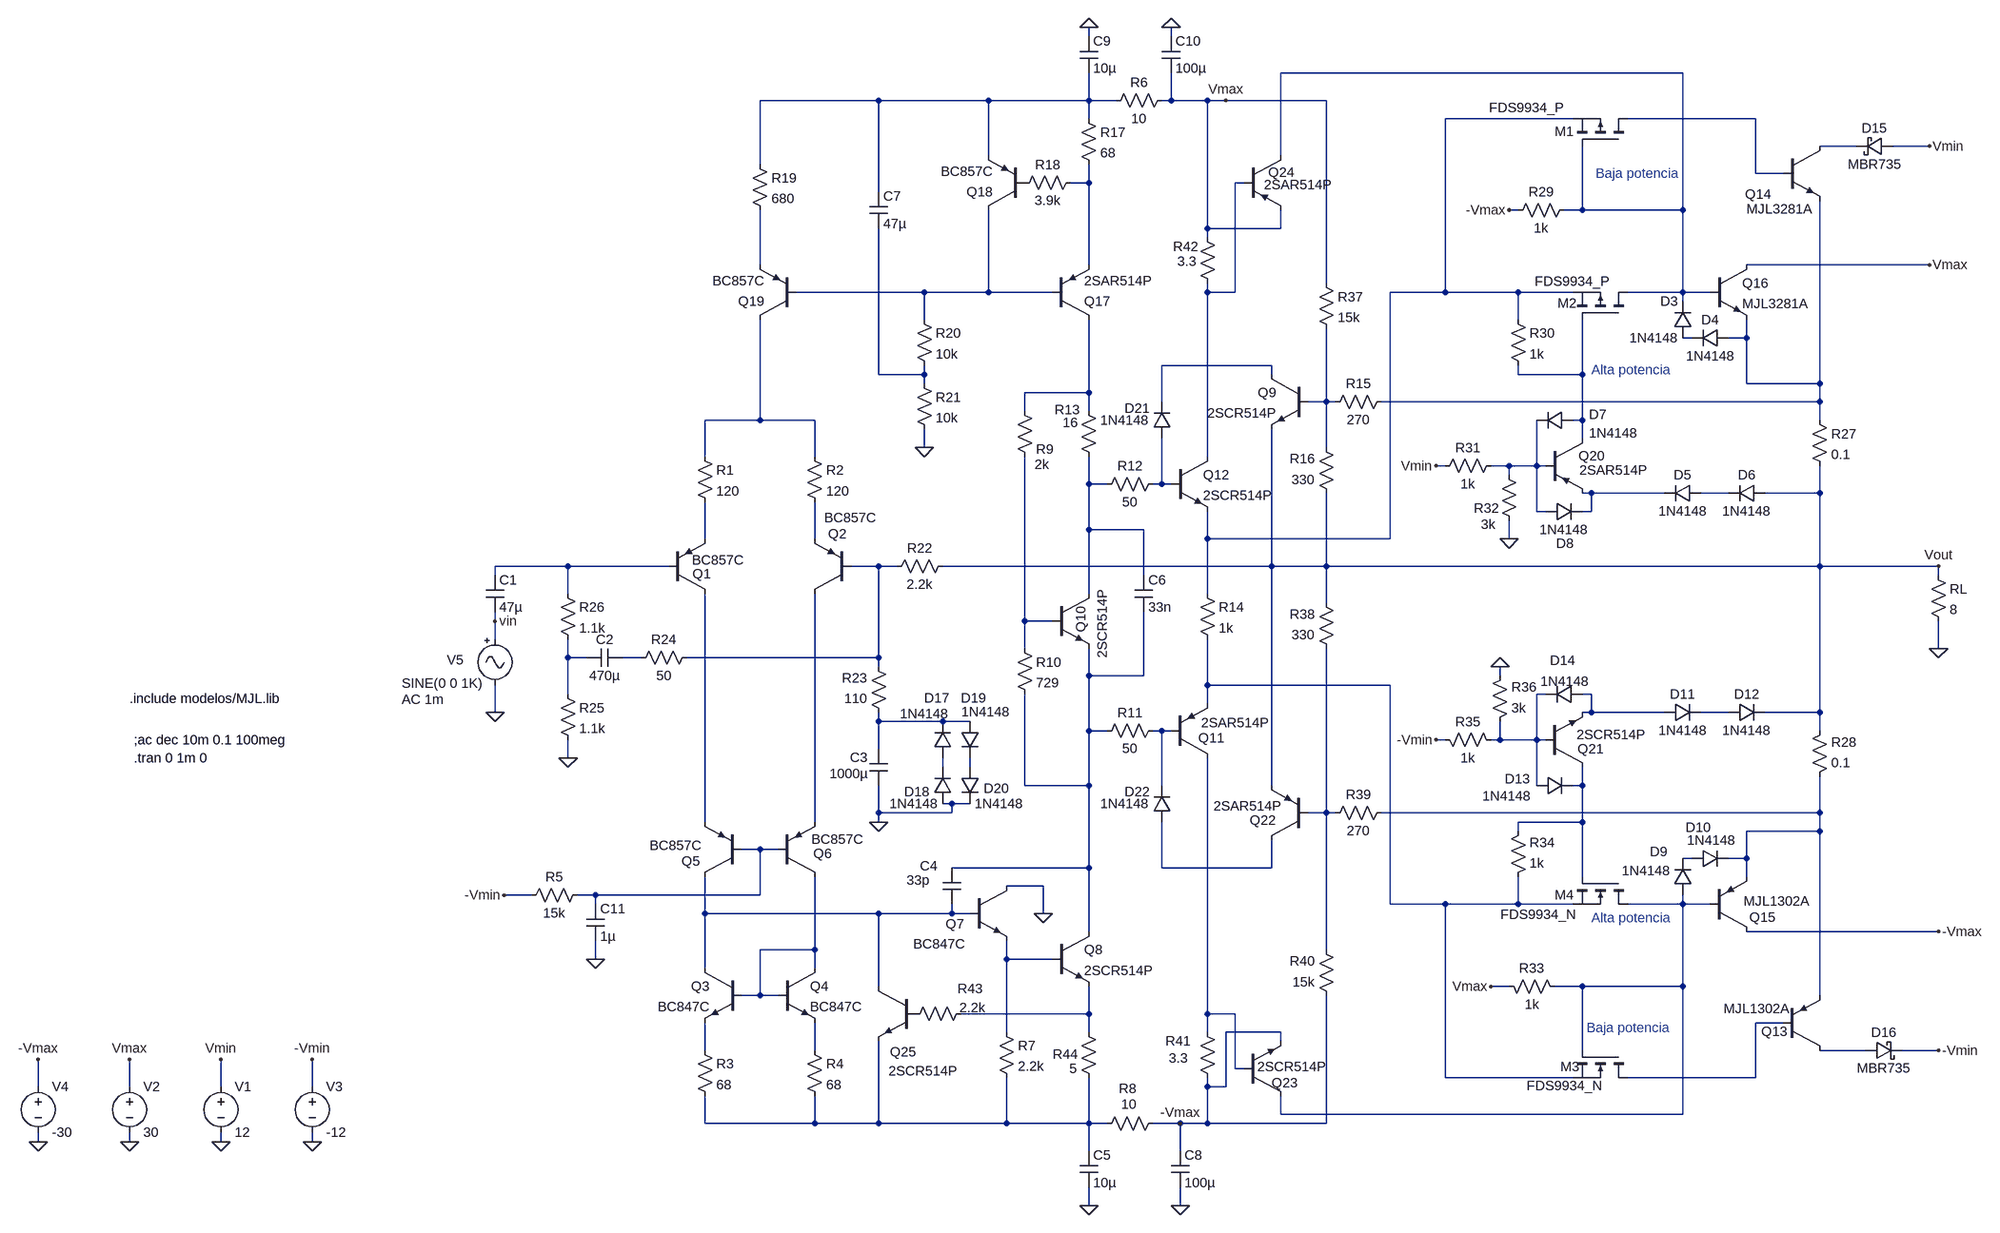
[diagram p0: schematic tp_final_amplificador_completo.asc]
tp_final_amplificador_completo.asc, the LTspice schematic file:
Version 4
SHEET 1 1968 1748
WIRE -512 -320 -512 -336
WIRE -368 -320 -368 -336
WIRE 528 -256 -176 -256
WIRE -880 -208 -1088 -208
WIRE -688 -208 -880 -208
WIRE -512 -208 -512 -256
WIRE -512 -208 -688 -208
WIRE -464 -208 -512 -208
WIRE -368 -208 -368 -256
WIRE -368 -208 -384 -208
WIRE -304 -208 -368 -208
WIRE -272 -208 -304 -208
WIRE -96 -208 -272 -208
WIRE -512 -176 -512 -208
WIRE 336 -176 112 -176
WIRE 656 -176 432 -176
WIRE 832 -128 768 -128
WIRE 960 -128 896 -128
WIRE -688 -112 -688 -208
WIRE -176 -112 -176 -256
WIRE -1088 -96 -1088 -208
WIRE 656 -80 656 -176
WIRE 704 -80 656 -80
WIRE -512 -64 -512 -96
WIRE -512 -64 -544 -64
WIRE -240 -64 -256 -64
WIRE -880 -48 -880 -208
WIRE 240 -16 224 -16
WIRE 352 -16 352 -128
WIRE 352 -16 320 -16
WIRE 528 -16 528 -256
WIRE 528 -16 352 -16
WIRE -304 16 -304 -208
WIRE -176 16 -176 -16
WIRE -176 16 -304 16
WIRE -304 32 -304 16
WIRE -1088 80 -1088 -16
WIRE -512 80 -512 -64
WIRE 960 80 640 80
WIRE -96 112 -96 -208
WIRE -800 128 -1024 128
WIRE -688 128 -688 -16
WIRE -688 128 -800 128
WIRE -576 128 -688 128
WIRE -304 128 -304 112
WIRE -256 128 -256 -64
WIRE -256 128 -304 128
WIRE 112 128 112 -176
WIRE 112 128 16 128
WIRE 240 128 112 128
WIRE 336 128 240 128
WIRE 528 128 528 -16
WIRE 528 128 432 128
WIRE 576 128 528 128
WIRE 528 144 528 128
WIRE -800 176 -800 128
WIRE 240 176 240 128
WIRE 544 208 528 208
WIRE 640 208 640 176
WIRE 640 208 608 208
WIRE -192 256 -384 256
WIRE -880 272 -880 16
WIRE -800 272 -800 256
WIRE -800 272 -880 272
WIRE -192 272 -192 256
WIRE 240 272 240 256
WIRE 352 272 352 176
WIRE 352 272 240 272
WIRE -800 288 -800 272
WIRE 640 288 640 208
WIRE 768 288 768 -32
WIRE 768 288 640 288
WIRE -512 304 -512 176
WIRE -512 304 -624 304
WIRE -384 320 -384 256
WIRE -96 320 -96 192
WIRE -96 320 -128 320
WIRE -80 320 -96 320
WIRE 768 320 768 288
WIRE 768 320 0 320
WIRE -624 336 -624 304
WIRE -512 336 -512 304
WIRE -1088 352 -1088 176
WIRE -1088 352 -1184 352
WIRE -992 352 -1088 352
WIRE 352 352 352 272
WIRE 352 352 336 352
WIRE 768 352 768 320
WIRE 352 384 352 352
WIRE -800 400 -800 368
WIRE -96 400 -96 320
WIRE -1184 416 -1184 352
WIRE -992 416 -992 352
WIRE -304 416 -304 128
WIRE 112 432 96 432
WIRE 224 432 192 432
WIRE 272 432 272 352
WIRE 272 432 224 432
WIRE 288 432 272 432
WIRE 224 448 224 432
WIRE -512 464 -512 416
WIRE -480 464 -512 464
WIRE -384 464 -384 384
WIRE -384 464 -400 464
WIRE -368 464 -384 464
WIRE 368 480 352 480
WIRE 496 480 368 480
WIRE 608 480 560 480
WIRE 768 480 768 432
WIRE 768 480 672 480
WIRE 272 512 272 432
WIRE 288 512 272 512
WIRE 368 512 368 480
WIRE 368 512 352 512
WIRE -512 544 -512 464
WIRE -416 544 -512 544
WIRE -1184 560 -1184 496
WIRE -992 560 -992 496
WIRE -304 560 -304 512
WIRE 16 560 16 128
WIRE 16 560 -304 560
WIRE 224 560 224 528
WIRE -1424 608 -1552 608
WIRE -1248 608 -1424 608
WIRE -880 608 -928 608
WIRE -848 608 -880 608
WIRE -192 608 -192 368
WIRE -192 608 -768 608
WIRE -96 608 -96 480
WIRE -96 608 -192 608
WIRE 768 608 768 480
WIRE 768 608 -96 608
WIRE 976 608 768 608
WIRE -1552 624 -1552 608
WIRE -416 624 -416 544
WIRE 976 624 976 608
WIRE -1424 656 -1424 608
WIRE -512 656 -512 544
WIRE -304 656 -304 560
WIRE -96 672 -96 608
WIRE -1552 704 -1552 688
WIRE -624 704 -624 416
WIRE -576 704 -624 704
WIRE -1552 736 -1552 704
WIRE -624 752 -624 704
WIRE 976 752 976 704
WIRE -1424 768 -1424 736
WIRE -1392 768 -1424 768
WIRE -1296 768 -1328 768
WIRE -880 768 -880 608
WIRE -880 768 -1216 768
WIRE -880 784 -880 768
WIRE -512 800 -512 752
WIRE -416 800 -416 688
WIRE -416 800 -512 800
WIRE 208 800 208 784
WIRE -304 816 -304 736
WIRE 16 816 -304 816
WIRE -1424 832 -1424 768
WIRE 288 832 272 832
WIRE 368 832 352 832
WIRE -304 848 -304 816
WIRE -1552 864 -1552 816
WIRE 368 864 368 832
WIRE 368 864 352 864
WIRE 496 864 368 864
WIRE 608 864 560 864
WIRE 768 864 768 608
WIRE 768 864 672 864
WIRE -880 880 -880 864
WIRE -768 880 -880 880
WIRE -720 880 -768 880
WIRE -512 896 -512 800
WIRE -480 896 -512 896
WIRE -384 896 -400 896
WIRE -368 896 -384 896
WIRE 768 896 768 864
WIRE 112 912 96 912
WIRE 208 912 208 880
WIRE 208 912 192 912
WIRE 272 912 272 832
WIRE 272 912 208 912
WIRE 288 912 272 912
WIRE -880 928 -880 880
WIRE -1424 944 -1424 912
WIRE -768 960 -768 944
WIRE -720 960 -720 944
WIRE -624 992 -624 832
WIRE -512 992 -512 896
WIRE -512 992 -624 992
WIRE -384 992 -384 896
WIRE -192 992 -192 608
WIRE 272 992 272 912
WIRE 352 992 352 960
WIRE 352 992 336 992
WIRE -752 1024 -768 1024
WIRE -720 1024 -752 1024
WIRE -880 1040 -880 992
WIRE -752 1040 -752 1024
WIRE -752 1040 -880 1040
WIRE -96 1040 -96 752
WIRE -96 1040 -128 1040
WIRE -80 1040 -96 1040
WIRE 768 1040 768 976
WIRE 768 1040 0 1040
WIRE -1184 1056 -1184 656
WIRE -992 1056 -992 656
WIRE -880 1056 -880 1040
WIRE 352 1056 352 992
WIRE 352 1056 240 1056
WIRE 240 1072 240 1056
WIRE 768 1072 768 1040
WIRE 768 1072 640 1072
WIRE -1088 1104 -1120 1104
WIRE -1056 1104 -1088 1104
WIRE 544 1120 528 1120
WIRE 640 1120 640 1072
WIRE 640 1120 608 1120
WIRE -512 1136 -512 992
WIRE -512 1136 -752 1136
WIRE -384 1136 -384 1056
WIRE -192 1136 -192 1088
WIRE -192 1136 -384 1136
WIRE 352 1152 352 1056
WIRE 640 1152 640 1120
WIRE -592 1168 -656 1168
WIRE -1488 1184 -1536 1184
WIRE -1376 1184 -1408 1184
WIRE -1088 1184 -1088 1104
WIRE -1088 1184 -1376 1184
WIRE -1376 1200 -1376 1184
WIRE 16 1200 16 816
WIRE 112 1200 16 1200
WIRE 240 1200 240 1152
WIRE 240 1200 112 1200
WIRE 336 1200 240 1200
WIRE 528 1200 528 1184
WIRE 528 1200 432 1200
WIRE 576 1200 528 1200
WIRE -1184 1216 -1184 1152
WIRE -880 1216 -1184 1216
WIRE -752 1216 -752 1200
WIRE -752 1216 -880 1216
WIRE -720 1216 -752 1216
WIRE -592 1216 -592 1168
WIRE -512 1248 -512 1136
WIRE 976 1248 640 1248
WIRE -992 1280 -992 1152
WIRE -992 1280 -1088 1280
WIRE -96 1280 -96 1040
WIRE -1376 1296 -1376 1264
WIRE -656 1296 -656 1264
WIRE -576 1296 -656 1296
WIRE -1184 1312 -1184 1216
WIRE -992 1312 -992 1280
WIRE -880 1344 -880 1216
WIRE 224 1344 192 1344
WIRE 352 1344 304 1344
WIRE 528 1344 528 1200
WIRE 528 1344 352 1344
WIRE -1088 1360 -1088 1280
WIRE -1088 1360 -1120 1360
WIRE -1056 1360 -1088 1360
WIRE 768 1360 768 1072
WIRE -512 1392 -512 1344
WIRE -512 1392 -736 1392
WIRE -304 1392 -304 944
WIRE -256 1392 -304 1392
WIRE 704 1408 656 1408
WIRE -656 1424 -656 1296
WIRE -512 1424 -512 1392
WIRE -304 1424 -304 1392
WIRE -176 1424 -272 1424
WIRE -176 1440 -176 1424
WIRE -1184 1456 -1184 1408
WIRE -992 1456 -992 1408
WIRE 352 1456 352 1344
WIRE 848 1456 768 1456
WIRE 976 1456 912 1456
WIRE -256 1488 -256 1392
WIRE -240 1488 -256 1488
WIRE 112 1504 112 1200
WIRE 336 1504 112 1504
WIRE 656 1504 656 1408
WIRE 656 1504 432 1504
WIRE -2352 1520 -2352 1472
WIRE -2192 1520 -2192 1472
WIRE -2032 1520 -2032 1472
WIRE -1872 1520 -1872 1472
WIRE -304 1520 -304 1504
WIRE -272 1520 -272 1424
WIRE -272 1520 -304 1520
WIRE -176 1568 -176 1536
WIRE 528 1568 528 1344
WIRE 528 1568 -176 1568
WIRE -1184 1584 -1184 1536
WIRE -992 1584 -992 1536
WIRE -992 1584 -1184 1584
WIRE -880 1584 -880 1440
WIRE -880 1584 -992 1584
WIRE -656 1584 -656 1504
WIRE -656 1584 -880 1584
WIRE -512 1584 -512 1504
WIRE -512 1584 -656 1584
WIRE -480 1584 -512 1584
WIRE -352 1584 -400 1584
WIRE -304 1584 -304 1520
WIRE -304 1584 -352 1584
WIRE -96 1584 -96 1360
WIRE -96 1584 -304 1584
WIRE -2352 1616 -2352 1600
WIRE -2192 1616 -2192 1600
WIRE -2032 1616 -2032 1600
WIRE -1872 1616 -1872 1600
WIRE -512 1632 -512 1584
WIRE -352 1632 -352 1584
WIRE -512 1728 -512 1696
WIRE -352 1728 -352 1696
FLAG -592 1216 0
FLAG -800 400 0
FLAG -880 1056 0
FLAG -1424 944 0
FLAG -1552 864 0
FLAG -2032 1616 0
FLAG -2032 1472 Vmin
FLAG -2192 1472 Vmax
FLAG -2192 1616 0
FLAG -1872 1616 0
FLAG -1872 1472 -Vmin
FLAG -2352 1472 -Vmax
FLAG -2352 1616 0
FLAG 960 -128 Vmin
FLAG 960 80 Vmax
FLAG 96 432 Vmin
FLAG 224 560 0
FLAG 976 1456 -Vmin
FLAG 976 1248 -Vmax
FLAG 96 912 -Vmin
FLAG -352 1584 -Vmax
FLAG 224 -16 -Vmax
FLAG 192 1344 Vmax
FLAG 976 608 Vout
FLAG -1552 704 vin
FLAG -1536 1184 -Vmin
FLAG -512 1728 0
FLAG 208 784 0
FLAG -352 1728 0
FLAG -512 -336 0
FLAG -368 -336 0
FLAG -272 -208 Vmax
FLAG 976 752 0
FLAG -1376 1296 0
SYMBOL pnp -1248 656 M180
WINDOW 0 42 35 Left 2
WINDOW 3 41 59 Left 2
SYMATTR InstName Q1
SYMATTR Value BC857C
SYMBOL pnp -928 656 R180
WINDOW 0 8 105 Left 2
WINDOW 3 -44 133 Left 2
SYMATTR InstName Q2
SYMATTR Value BC857C
SYMBOL pnp -1024 176 R180
SYMATTR InstName Q19
SYMATTR Value BC857C
SYMBOL pnp -624 -16 R180
SYMATTR InstName Q18
SYMATTR Value BC857C
SYMBOL npn -1120 1312 M0
SYMATTR InstName Q3
SYMATTR Value BC847C
SYMBOL npn -1056 1312 R0
SYMATTR InstName Q4
SYMATTR Value BC847C
SYMBOL res -1008 1440 R0
SYMATTR InstName R4
SYMATTR Value 68
SYMBOL res -1200 1440 R0
SYMATTR InstName R3
SYMATTR Value 68
SYMBOL res -1200 400 R0
SYMATTR InstName R1
SYMATTR Value 120
SYMBOL res -1008 400 R0
SYMATTR InstName R2
SYMATTR Value 120
SYMBOL res -1104 -112 R0
SYMATTR InstName R19
SYMATTR Value 680
SYMBOL res -528 -192 R0
SYMATTR InstName R17
SYMATTR Value 68
SYMBOL pnp -576 176 M180
SYMATTR InstName Q17
SYMATTR Value 2SAR514P
SYMBOL npn -720 1168 R0
WINDOW 0 -43 67 Left 2
WINDOW 3 -99 102 Left 2
SYMATTR InstName Q7
SYMATTR Value BC847C
SYMBOL npn -576 1248 R0
SYMATTR InstName Q8
SYMATTR Value 2SCR514P
SYMBOL res -672 1408 R0
SYMATTR InstName R7
SYMATTR Value 2.2k
SYMBOL res -384 880 R90
WINDOW 0 0 56 VBottom 2
WINDOW 3 32 56 VTop 2
SYMATTR InstName R11
SYMATTR Value 50
SYMBOL npn -368 416 R0
SYMATTR InstName Q12
SYMATTR Value 2SCR514P
SYMBOL pnp -368 944 M180
WINDOW 0 48 35 Left 2
WINDOW 3 53 62 Left 2
SYMATTR InstName Q11
SYMATTR Value 2SAR514P
SYMBOL npn -576 656 R0
WINDOW 0 51 69 VLeft 2
WINDOW 3 88 -7 VRight 2
SYMATTR InstName Q10
SYMATTR Value 2SCR514P
SYMBOL res -640 320 R0
WINDOW 0 36 83 Left 2
WINDOW 3 33 110 Left 2
SYMATTR InstName R9
SYMATTR Value 2k
SYMBOL res -640 736 R0
SYMATTR InstName R10
SYMATTR Value 729
SYMBOL res -528 320 R0
WINDOW 0 -44 14 Left 2
WINDOW 3 -30 36 Left 2
SYMATTR InstName R13
SYMATTR Value 16
SYMBOL res -816 160 R0
SYMATTR InstName R20
SYMATTR Value 10k
SYMBOL res -816 272 R0
SYMATTR InstName R21
SYMATTR Value 10k
SYMBOL res -752 592 R90
WINDOW 0 0 56 VBottom 2
WINDOW 3 32 56 VTop 2
SYMATTR InstName R22
SYMATTR Value 2.2k
SYMBOL res -864 880 R180
WINDOW 0 36 76 Left 2
WINDOW 3 36 40 Left 2
SYMATTR InstName R23
SYMATTR Value 110
SYMBOL cap -896 928 R0
WINDOW 0 -34 15 Left 2
WINDOW 3 -70 43 Left 2
SYMATTR InstName C3
SYMATTR Value 1000µ
SYMBOL res -1200 752 R90
WINDOW 0 0 56 VBottom 2
WINDOW 3 32 56 VTop 2
SYMATTR InstName R24
SYMATTR Value 50
SYMBOL cap -1328 752 R90
WINDOW 0 0 32 VBottom 2
WINDOW 3 32 32 VTop 2
SYMATTR InstName C2
SYMATTR Value 470µ
SYMBOL res -1440 640 R0
SYMATTR InstName R26
SYMATTR Value 1.1k
SYMBOL res -1440 816 R0
SYMATTR InstName R25
SYMATTR Value 1.1k
SYMBOL cap -1568 624 R0
SYMATTR InstName C1
SYMATTR Value 47µ
SYMBOL cap -768 1136 R0
WINDOW 0 -40 -3 Left 2
WINDOW 3 -63 22 Left 2
SYMATTR InstName C4
SYMATTR Value 33p
SYMBOL res -384 448 R90
WINDOW 0 0 56 VBottom 2
WINDOW 3 32 56 VTop 2
SYMATTR InstName R12
SYMATTR Value 50
SYMBOL voltage -2032 1504 R0
WINDOW 123 0 0 Left 0
WINDOW 39 0 0 Left 0
SYMATTR InstName V1
SYMATTR Value 12
SYMBOL voltage -2192 1504 R0
WINDOW 123 0 0 Left 0
WINDOW 39 0 0 Left 0
SYMATTR InstName V2
SYMATTR Value 30
SYMBOL voltage -1872 1504 R0
WINDOW 123 0 0 Left 0
WINDOW 39 0 0 Left 0
SYMATTR InstName V3
SYMATTR Value -12
SYMBOL voltage -2352 1504 R0
WINDOW 123 0 0 Left 0
WINDOW 39 0 0 Left 0
SYMATTR InstName V4
SYMATTR Value -30
SYMBOL pmos 432 176 M270
WINDOW 0 29 123 VLeft 2
WINDOW 3 67 163 VLeft 2
SYMATTR InstName M2
SYMATTR Value FDS9934_P
SYMBOL pmos 432 -128 M270
WINDOW 0 26 128 VLeft 2
WINDOW 3 67 243 VLeft 2
SYMATTR InstName M1
SYMATTR Value FDS9934_P
SYMBOL pnp 288 384 R0
WINDOW 0 58 31 Left 2
WINDOW 3 59 56 Left 2
SYMATTR InstName Q20
SYMATTR Value 2SAR514P
SYMBOL npn 576 80 R0
SYMATTR InstName Q16
SYMATTR Value MJL3281A
SYMBOL npn 704 -128 R0
WINDOW 0 -67 84 Left 2
WINDOW 3 -64 110 Left 2
SYMATTR InstName Q14
SYMATTR Value MJL3281A
SYMBOL res 208 416 R90
WINDOW 0 0 56 VBottom 2
WINDOW 3 32 56 VTop 2
SYMATTR InstName R31
SYMATTR Value 1k
SYMBOL schottky 896 -144 R90
WINDOW 0 0 32 VBottom 2
WINDOW 3 32 32 VTop 2
SYMATTR InstName D15
SYMATTR Value MBR735
SYMATTR Description Diode
SYMATTR Type diode
SYMBOL res 208 432 R0
WINDOW 0 -46 74 Left 2
WINDOW 3 -33 103 Left 2
SYMATTR InstName R32
SYMATTR Value 3k
SYMBOL res 208 928 M270
WINDOW 0 32 56 VTop 2
WINDOW 3 0 56 VBottom 2
SYMATTR InstName R35
SYMATTR Value 1k
SYMBOL schottky 848 1440 M90
WINDOW 0 0 32 VBottom 2
WINDOW 3 32 32 VTop 2
SYMATTR InstName D16
SYMATTR Value MBR735
SYMATTR Description Diode
SYMATTR Type diode
SYMBOL pnp 704 1456 M180
WINDOW 0 -38 33 Left 2
WINDOW 3 -104 73 Left 2
SYMATTR InstName Q13
SYMATTR Value MJL1302A
SYMBOL pnp 576 1248 M180
WINDOW 0 69 25 Left 2
WINDOW 3 59 53 Left 2
SYMATTR InstName Q15
SYMATTR Value MJL1302A
SYMBOL nmos 432 1456 R90
WINDOW 0 29 118 VLeft 2
WINDOW 3 62 177 VLeft 2
SYMATTR InstName M3
SYMATTR Value FDS9934_N
SYMBOL nmos 432 1152 R90
WINDOW 0 32 128 VLeft 2
WINDOW 3 66 223 VLeft 2
SYMATTR InstName M4
SYMATTR Value FDS9934_N
SYMBOL npn 288 960 M180
WINDOW 3 54 57 Left 2
SYMATTR Value 2SCR514P
SYMATTR InstName Q21
SYMBOL res 960 608 R0
SYMATTR InstName RL
SYMATTR Value 8
SYMBOL res -320 640 R0
SYMATTR InstName R14
SYMATTR Value 1k
SYMBOL diode 560 464 R90
WINDOW 0 0 32 VBottom 2
WINDOW 3 32 32 VTop 2
SYMATTR InstName D5
SYMATTR Value 1N4148
SYMBOL diode 496 848 M90
WINDOW 0 0 32 VBottom 2
WINDOW 3 32 32 VTop 2
SYMATTR InstName D11
SYMATTR Value 1N4148
SYMBOL res 336 -32 R90
WINDOW 0 0 56 VBottom 2
WINDOW 3 32 56 VTop 2
SYMATTR InstName R29
SYMATTR Value 1k
SYMBOL res 208 1328 M90
WINDOW 0 0 56 VBottom 2
WINDOW 3 32 56 VTop 2
SYMATTR InstName R33
SYMATTR Value 1k
SYMBOL res 752 336 R0
SYMATTR InstName R27
SYMATTR Value 0.1
SYMBOL diode 288 528 R270
WINDOW 0 -56 34 VTop 2
WINDOW 3 0 32 VBottom 2
SYMATTR InstName D8
SYMATTR Value 1N4148
SYMBOL diode 352 848 M270
WINDOW 0 59 34 VTop 2
WINDOW 3 54 31 VBottom 2
SYMATTR InstName D14
SYMATTR Value 1N4148
SYMBOL res 752 992 M180
WINDOW 0 36 76 Left 2
WINDOW 3 36 40 Left 2
SYMATTR InstName R28
SYMATTR Value 0.1
SYMBOL diode 608 192 R90
WINDOW 0 0 32 VBottom 2
WINDOW 3 32 32 VTop 2
SYMATTR InstName D4
SYMATTR Value 1N4148
SYMBOL diode 544 1104 M90
WINDOW 0 -23 11 VBottom 2
WINDOW 3 22 -80 VTop 2
SYMATTR InstName D10
SYMATTR Value 1N4148
SYMBOL res -528 -80 R90
WINDOW 0 0 56 VBottom 2
WINDOW 3 32 56 VTop 2
SYMATTR InstName R18
SYMATTR Value 3.9k
SYMBOL pnp -1120 1152 R180
WINDOW 0 73 27 Left 2
WINDOW 3 70 55 Left 2
SYMATTR InstName Q5
SYMATTR Value BC857C
SYMBOL pnp -1056 1152 M180
WINDOW 0 62 41 Left 2
WINDOW 3 58 66 Left 2
SYMATTR InstName Q6
SYMATTR Value BC857C
SYMBOL res -1392 1168 R90
WINDOW 0 0 56 VBottom 2
WINDOW 3 32 56 VTop 2
SYMATTR InstName R5
SYMATTR Value 15k
SYMBOL res -384 1568 R90
WINDOW 0 -29 60 VBottom 2
WINDOW 3 -33 58 VTop 2
SYMATTR InstName R8
SYMATTR Value 10
SYMBOL cap -896 -48 R0
SYMATTR InstName C7
SYMATTR Value 47µ
SYMBOL cap -528 1632 R0
SYMATTR InstName C5
SYMATTR Value 10µ
SYMBOL Misc\\signal -1552 720 R0
WINDOW 0 -84 52 Left 2
WINDOW 3 -163 93 Left 2
WINDOW 123 -163 121 Left 2
WINDOW 39 0 0 Left 0
SYMATTR InstName V5
SYMATTR Value SINE(0 0 1K)
SYMATTR Value2 AC 1m
SYMBOL cap -432 624 R0
SYMATTR InstName C6
SYMATTR Value 33n
SYMBOL diode 336 336 R90
WINDOW 0 22 -43 VBottom 2
WINDOW 3 23 -70 VTop 2
SYMATTR InstName D7
SYMATTR Value 1N4148
SYMBOL diode 272 976 M90
WINDOW 0 20 -33 VBottom 2
WINDOW 3 19 -52 VTop 2
SYMATTR InstName D13
SYMATTR Value 1N4148
SYMBOL res 192 896 M180
WINDOW 0 36 76 Left 2
WINDOW 3 36 40 Left 2
SYMATTR InstName R36
SYMATTR Value 3k
SYMBOL diode 672 464 R90
WINDOW 0 0 32 VBottom 2
WINDOW 3 32 32 VTop 2
SYMATTR InstName D6
SYMATTR Value 1N4148
SYMBOL diode 608 848 M90
WINDOW 0 0 32 VBottom 2
WINDOW 3 32 32 VTop 2
SYMATTR InstName D12
SYMATTR Value 1N4148
SYMBOL diode 544 208 R180
WINDOW 0 24 64 Left 2
WINDOW 3 24 0 Left 2
SYMATTR InstName D3
SYMATTR Value 1N4148
SYMBOL res 224 160 R0
SYMATTR InstName R30
SYMATTR Value 1k
SYMBOL res 224 1168 M180
WINDOW 0 36 76 Left 2
WINDOW 3 36 40 Left 2
SYMATTR InstName R34
SYMATTR Value 1k
SYMBOL diode 512 1184 M180
WINDOW 0 -41 76 Left 2
WINDOW 3 24 96 Left 2
SYMATTR InstName D9
SYMATTR Value 1N4148
SYMBOL res -368 -224 R90
WINDOW 0 0 56 VBottom 2
WINDOW 3 32 56 VTop 2
SYMATTR InstName R6
SYMATTR Value 10
SYMBOL cap -368 1632 R0
SYMATTR InstName C8
SYMATTR Value 100µ
SYMBOL cap -528 -320 R0
SYMATTR InstName C9
SYMATTR Value 10µ
SYMBOL cap -384 -320 R0
SYMATTR InstName C10
SYMATTR Value 100µ
SYMBOL diode -752 944 R180
WINDOW 0 4 105 Left 2
WINDOW 3 6 78 Left 2
SYMATTR InstName D17
SYMATTR Value 1N4148
SYMBOL diode -752 1024 R180
WINDOW 0 39 21 Left 2
WINDOW 3 24 0 Left 2
SYMATTR InstName D18
SYMATTR Value 1N4148
SYMBOL diode -736 880 R0
WINDOW 0 0 -41 Left 2
WINDOW 3 1 -17 Left 2
SYMATTR InstName D19
SYMATTR Value 1N4148
SYMBOL diode -736 960 R0
WINDOW 0 40 37 Left 2
SYMATTR InstName D20
SYMATTR Value 1N4148
SYMBOL npn -128 272 M0
SYMATTR InstName Q9
SYMATTR Value 2SCR514P
SYMBOL res 16 304 R90
WINDOW 0 0 56 VBottom 2
WINDOW 3 32 56 VTop 2
SYMATTR InstName R15
SYMATTR Value 270
SYMBOL res -80 496 R180
WINDOW 0 36 76 Left 2
WINDOW 3 36 40 Left 2
SYMATTR InstName R16
SYMATTR Value 330
SYMBOL res -112 96 R0
SYMATTR InstName R37
SYMATTR Value 15k
SYMBOL pnp -128 1088 R180
WINDOW 0 56 35 Left 2
WINDOW 3 47 60 Left 2
SYMATTR InstName Q22
SYMATTR Value 2SAR514P
SYMBOL res -80 768 R180
WINDOW 0 36 76 Left 2
WINDOW 3 36 40 Left 2
SYMATTR InstName R38
SYMATTR Value 330
SYMBOL res -96 1056 R270
WINDOW 0 32 56 VTop 2
WINDOW 3 0 56 VBottom 2
SYMATTR InstName R39
SYMATTR Value 270
SYMBOL res -80 1376 R180
WINDOW 0 36 76 Left 2
WINDOW 3 36 40 Left 2
SYMATTR InstName R40
SYMATTR Value 15k
SYMBOL diode -368 384 R180
WINDOW 0 37 53 Left 2
WINDOW 3 39 32 Left 2
SYMATTR InstName D21
SYMATTR Value 1N4148
SYMBOL diode -368 1056 R180
WINDOW 0 37 53 Left 2
WINDOW 3 39 32 Left 2
SYMATTR InstName D22
SYMATTR Value 1N4148
SYMBOL npn -240 1536 M180
WINDOW 0 48 23 Left 2
WINDOW 3 23 51 Left 2
SYMATTR InstName Q23
SYMATTR Value 2SCR514P
SYMBOL res -320 1408 R0
WINDOW 0 -58 32 Left 2
WINDOW 3 -52 62 Left 2
SYMATTR InstName R41
SYMATTR Value 3.3
SYMBOL res -320 16 R0
WINDOW 0 -44 32 Left 2
WINDOW 3 -37 58 Left 2
SYMATTR InstName R42
SYMATTR Value 3.3
SYMBOL pnp -240 -112 R0
WINDOW 0 42 30 Left 2
WINDOW 3 35 52 Left 2
SYMATTR InstName Q24
SYMATTR Value 2SAR514P
SYMBOL cap -1392 1200 R0
SYMATTR InstName C11
SYMATTR Value 1µ
SYMBOL npn -816 1344 M0
WINDOW 0 -2 115 Left 2
WINDOW 3 -73 148 Left 2
SYMATTR InstName Q25
SYMATTR Value 2SCR514P
SYMBOL res -832 1408 R270
WINDOW 0 44 112 VTop 2
WINDOW 3 42 116 VBottom 2
SYMATTR InstName R43
SYMATTR Value 2.2k
SYMBOL res -528 1408 R0
WINDOW 0 -47 55 Left 2
WINDOW 3 -18 80 Left 2
SYMATTR InstName R44
SYMATTR Value 5
TEXT -2192 840 Left 2 !.include modelos/MJL.lib
TEXT 376 -80 Left 2 ;Baja potencia
TEXT 368 264 Left 2 ;Alta potencia
TEXT 360 1416 Left 2 ;Baja potencia
TEXT 368 1224 Left 2 ;Alta potencia
TEXT -2184 912 Left 2 !;ac dec 10m 0.1 100meg
TEXT -2184 944 Left 2 !.tran 0 1m 0

The netlist it stands for:
* tp_final_amplificador_completo.asc
Q1 N042 N025 N023 0 BC857C
Q2 N043 N026 N024 0 BC857C
Q19 N017 N009 N008 0 BC857C
Q18 N009 P001 N002 0 BC857C
Q3 N048 N049 N054 0 BC847C
Q4 N049 N049 N055 0 BC847C
R4 N055 N057 68
R3 N054 N057 68
R1 N017 N023 120
R2 N017 N024 120
R19 N002 N008 680
R17 N002 N006 68
Q17 N015 N009 N006 0 2SAR514P
Q7 0 N048 N050 0 BC847C
Q8 N030 N050 N051 0 2SCR514P
R7 N050 N057 2.2k
R11 N036 N030 50
Q12 N007 N020 N003 0 2SCR514P
Q11 N052 N036 N031 0 2SAR514P
Q10 N019 N027 N030 0 2SCR514P
R9 N015 N027 2k
R10 N027 N030 729
R13 N015 N019 16
R20 N009 N013 10k
R21 N013 0 10k
R22 Vout N026 2.2k
R23 N035 N026 110
C3 N035 0 1000µ
R24 N026 N029 50
C2 N029 N028 470µ
R26 N025 N028 1.1k
R25 N028 0 1.1k
C1 N025 vin 47µ
C4 N030 N048 33p
R12 N020 N019 50
V1 Vmin 0 12
V2 Vmax 0 30
V3 -Vmin 0 -12
V4 -Vmax 0 -30
M2 N001 N014 N003 N003 FDS9934_P
M1 N004 N001 N003 N003 FDS9934_P
Q20 N014 N018 N021 0 2SAR514P
Q16 Vmax N001 N011 0 MJL3281A
Q14 N005 N004 N011 0 MJL3281A
R31 N018 Vmin 1k
D15 Vmin N005 MBR735
R32 N018 0 3k
R35 N032 -Vmin 1k
D16 N056 -Vmin MBR735
Q13 N056 N053 N041 0 MJL1302A
Q15 -Vmax N047 N041 0 MJL1302A
M3 N053 N047 N031 N031 FDS9934_N
M4 N047 N039 N031 N031 FDS9934_N
Q21 N039 N032 N033 0 2SCR514P
RL Vout 0 8
R14 N003 N031 1k
D5 N022 N021 1N4148
D11 N033 N034 1N4148
R29 N001 -Vmax 1k
R33 Vmax N047 1k
R27 N011 Vout 0.1
D8 N018 N021 1N4148
D14 N033 N032 1N4148
R28 N041 Vout 0.1
D4 N011 N010 1N4148
D10 N045 N041 1N4148
R18 N006 P001 3.9k
Q5 N048 N044 N042 0 BC857C
Q6 N049 N044 N043 0 BC857C
R5 N044 -Vmin 15k
R8 -Vmax N057 10
C7 N002 N013 47µ
C5 N057 0 10µ
V5 vin 0 SINE(0 0 1K) AC 1m
C6 N019 N030 33n
D7 N014 N018 1N4148
D13 N032 N039 1N4148
R36 N032 0 3k
D6 Vout N022 1N4148
D12 N034 Vout 1N4148
D3 N010 N001 1N4148
R30 N003 N014 1k
R34 N031 N039 1k
D9 N047 N045 1N4148
R6 Vmax N002 10
C8 -Vmax 0 100µ
C9 0 N002 10µ
C10 0 Vmax 100µ
D17 N037 N035 1N4148
D18 0 N037 1N4148
D19 N035 N038 1N4148
D20 N038 0 1N4148
Q9 N012 N016 Vout 0 2SCR514P
R15 N011 N016 270
R16 Vout N016 330
R37 Vmax N016 15k
Q22 N046 N040 Vout 0 2SAR514P
R38 N040 Vout 330
R39 N040 N041 270
R40 -Vmax N040 15k
D21 N020 N012 1N4148
D22 N046 N036 1N4148
Q23 N047 N052 -Vmax 0 2SCR514P
R41 N052 -Vmax 3.3
R42 Vmax N007 3.3
Q24 N001 N007 Vmax 0 2SAR514P
C11 N044 0 1µ
Q25 N048 P002 N057 0 2SCR514P
R43 P002 N051 2.2k
R44 N051 N057 5
.model D D
.lib standard.dio
.model NPN NPN
.model PNP PNP
.lib standard.bjt
.model NMOS NMOS
.model PMOS PMOS
.lib standard.mos
.include modelos/MJL.lib
* Baja potencia
* Alta potencia
* Baja potencia
* Alta potencia
;ac dec 10m 0.1 100meg
.tran 0 1m 0
.backanno
.end